# Altium schematic sheet Supply.SchDoc
size A4; SheetNumber: 2; SheetTotal: 8; Time: Supply
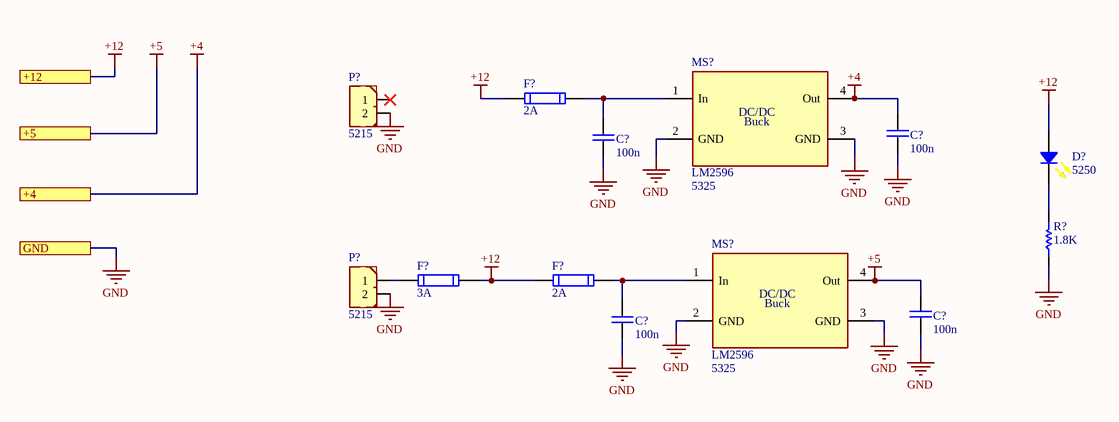
[diagram p0: Supply.SchDoc]

## Parts
(Parts that share a designator on the sheet are numbered #1, #2 ... from top to bottom, then left to right.)
C?#1  100n  [CAP 1206/3216]
C?#2  100n  [CAP 1206/3216]
C?#3  100n  [CAP 1206/3216]
C?#4  100n  [CAP 1206/3216]
D?  Inflow: 5250  [LED 1206/3216 YELLOW]  (hidden comment: Yellow, 1206)
F?#1  2A  [1206_F]
F?#2  3A  [1206_F]
F?#3  2A  [1206_F]
MS?#1  Inflow: 5325  [LM2596_modsen]  (hidden comment: LM2596)
MS?#2  Inflow: 5325  [LM2596_modsen]  (hidden comment: LM2596)
P?#1  Inflow: 5215  [645002117322]  (hidden comment: 2'Pin)
P?#2  Inflow: 5215  [645002117322]  (hidden comment: 2'Pin)
R?  1.8K  [RES 1206 (3216X08L)]

## Ports
+4, +5, +12, GND

## Nets
+4: C?#2.1 MS?#1.4(Out) ; port +4
+5: C?#4.1 MS?#2.4(Out) ; port +5
+12: D?.1 F?#1.1 F?#2.2 F?#3.1 ; port +12
GND: C?#1.2 C?#2.2 C?#3.2 C?#4.2 MS?#1.2(GND) MS?#1.3(GND) MS?#2.2(GND) MS?#2.3(GND) P?#1.2 P?#2.2 R?.1 ; port GND
NetC?#1_1: C?#1.1 F?#1.2 MS?#1.1(In)
NetC?#3_1: C?#3.1 F?#3.2 MS?#2.1(In)
NetD?_2: D?.2 R?.2
NetF?#2_1: F?#2.1 P?#2.1

Not connected (* = marked no-connect by the designer): P?#1 1*

## Notes on the sheet
- Title:
- Project:
- Drawn by:
- Revision:
- Hossein Bagheri
- Company:
- Sheet
- of
- (in symbol ModSen_LM2596) DC/DC; Buck

## Library data of the parts
C?#1-C?#4 = Cap_Multi_SMD_100nF_1206: Bipolar ceramic capacitor SMD; Type: MultiLayer; Inflow: inflow?; Rating: 50V; Validation: Valid; Package: 1206; Value: 100n
D? = Semi_LED_Yellow_1206: LED; Rating: Rating?; Type: Type?; Validation: Valid; Value: Yellow, 1206; Package: Package?
F?#1-F?#3 = Other_Elec_Fuse_SMD: Short circiut  protection; Inflow: inflow?; Type: Fast; Rating: Rating?; Validation: Valid; Package: 1206
  F?#1 F?#3: Value: 2A
  F?#2: Value: 3A
MS?#1 MS?#2 = ModSen_LM2596: DC to DC Buck converter 1.23V-30V 3A; Rating: Rating?; Validation: Valid; Package: Package?; Type: Type?; Value: LM2596
P?#1 P?#2 = Con_Power_2_PC_H: 2'Pin Power Connector; Rating: Rating?; Validation: Valid; Value: 2'Pin; Package: Package?; Type: Type?
R? = Res_SMD_1206: Resistor; Inflow: inflow?; Rating: 0.25W; Validation: Valid; Package: 1206; Type: 10%; Value: 1.8K